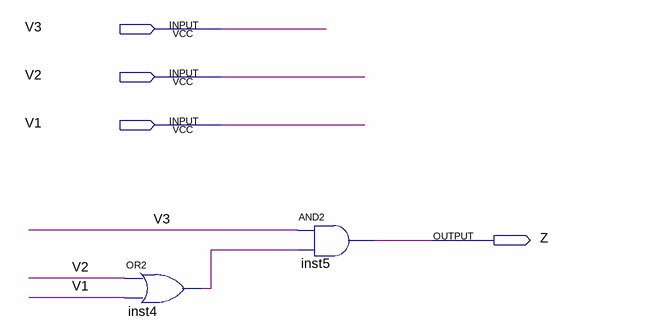
[diagram p0: schematic sheet]
// Quartus schematic comparator.bdf as structural Verilog: 2 symbols, 4 pins
module comparator (
  input  V3,
  input  V2,
  input  V1,
  output Z
);

  wire inst4_out;

  or inst4 (inst4_out, V2, V1);
  and inst5 (Z, V3, inst4_out);
endmodule
